# Altium project 声源跟踪小车_Project.PrjPcb
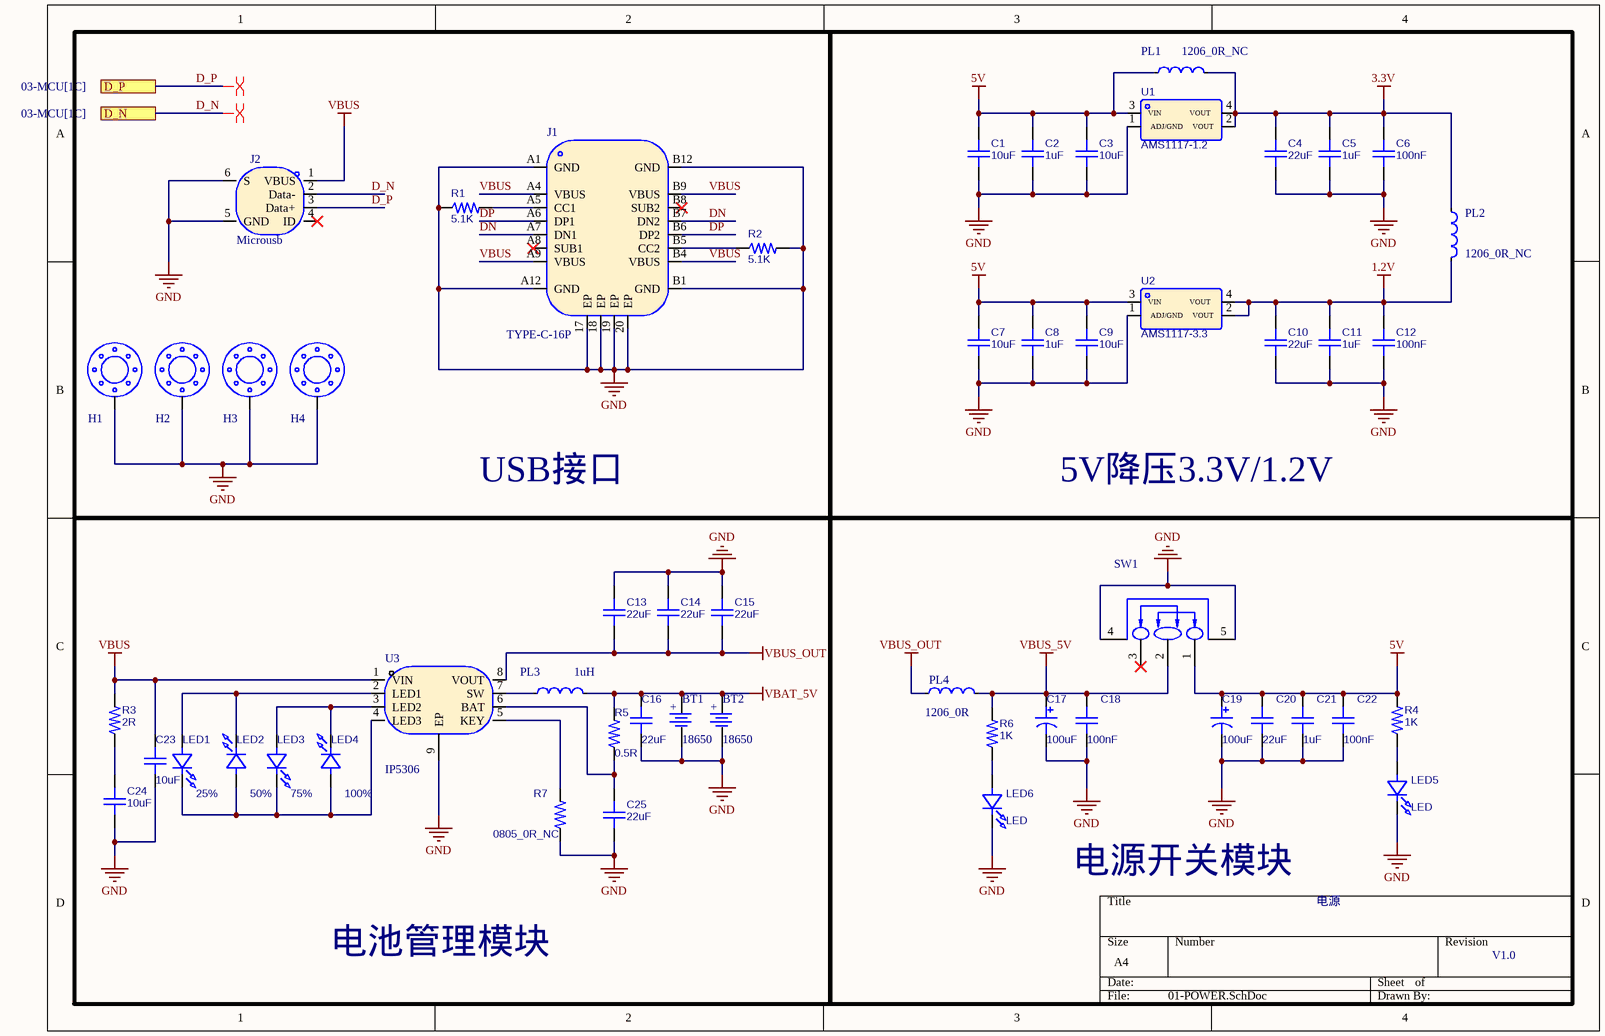
[diagram p0: 01-POWER.SchDoc]
3 sheets, 235 parts. Net scope: flat (ports and power ports of the same name join across sheets).
Board file: PCB1.PcbDoc
Sheets:
  01-POWER.SchDoc
  02-MIC.SchDoc
  03-MCU.SchDoc

## Sheet 01-POWER.SchDoc
size A4; SheetNumber: 1; SheetTotal: 2

### Parts
BT1  18650  [BAT-SMD-18650]
BT2  18650  [BAT-SMD-18650]
C1  10uF  [CAP-SMD-0603]
C2  1uF  [CAP-SMD-0603]
C3  10uF  [CAP-SMD-0603]
C4  22uF  [CAP-SMD-0603]
C5  1uF  [CAP-SMD-0603]
C6  100nF  [CAP-SMD-0603]
C7  10uF  [CAP-SMD-0603]
C8  1uF  [CAP-SMD-0603]
C9  10uF  [CAP-SMD-0603]
C10  22uF  [CAP-SMD-0603]
C11  1uF  [CAP-SMD-0603]
C12  100nF  [CAP-SMD-0603]
C13  22uF  [CAP-SMD-0603]
C14  22uF  [CAP-SMD-0603]
C15  22uF  [CAP-SMD-0603]
C16  22uF  [CAP-SMD-0603]
C17  100uF  [CAPA-TH-5020-P2.0]
C18  100nF  [CAP-SMD-0603]
C19  100uF  [CAPA-TH-5020-P2.0]
C20  22uF  [CAP-SMD-0603]
C21  1uF  [CAP-SMD-0603]
C22  100nF  [CAP-SMD-0603]
C23  10uF  [CAP-SMD-0603]
C24  10uF  [CAP-SMD-0603]
C25  22uF  [CAP-SMD-0603]
H1  M3  [M3-5030-0.3]  (value not drawn)
H2  M3  [M3-5030-0.3]  (value not drawn)
H3  M3  [M3-5030-0.3]  (value not drawn)
H4  M3  [M3-5030-0.3]  (value not drawn)
J1  TYPE-C-16P  [TYPE-C-SMD-16P]
J2  Microusb  [Microusb-SMD-5P]
LED1  25%  [LED-SMD-0805]
LED2  50%  [LED-SMD-0805]
LED3  75%  [LED-SMD-0805]
LED4  100%  [LED-SMD-0805]
LED5  LED  [LED-SMD-0805]
LED6  LED  [LED-SMD-0805]
PL1  1206_0R_NC  [PL-SMD_4.4X4.2-P3.7]
PL2  1206_0R_NC  [PL-SMD_4.4X4.2-P3.7]
PL3  1uH  [PL-SMD_4.4X4.2-P3.7]
PL4  1206_0R  [PL-SMD_4.4X4.2-P3.7]
R1  5.1K  [RES-SMD-0603]
R2  5.1K  [RES-SMD-0603]
R3  2R  [RES-SMD-0603]
R4  1K  [RES-SMD-0603]
R5  0.5R  [RES-SMD-0603]
R6  1K  [RES-SMD-0603]
R7  0805_0R_NC  [RES-SMD-0603]
SW1  SS-12D11G5  [SW-TH-D-P4.8]  (value not drawn)
U1  AMS1117-1.2  [SOT-223-4-LP5.7-P2.3]
U2  AMS1117-3.3  [SOT-223-4-LP5.7-P2.3]
U3  IP5306  [ESOP-8-LP5.3-P1.27]

### Blocks framed on the sheet
USB接口: H1-H4 J1 J2 R1 R2
5V降压3.3V/1.2V: C1-C12 PL1 PL2 U1 U2
电池管理模块: BT1 BT2 C13-C16 C23-C25 LED1-LED4 PL3 R3 R5 R7 U3
电源开关模块: C17-C22 LED5 LED6 PL4 R4 R6 SW1

### Ports
D_N (see 03-MCU[1C]), D_P (see 03-MCU[1C])

### Nets
1.2V: C10.2 C11.2 C12.2 PL2.2 U2.2(VOUT) U2.4(VOUT)
3.3V: C4.2 C5.2 C6.2 PL1.2 PL2.1 U1.2(VOUT) U1.4(VOUT)
5V: C1.2 C2.2 C3.2 C7.2 C8.2 C9.2 C19.1 C20.2 C21.2 C22.2 PL1.1 R4.2 SW1.1 U1.3(VIN) U2.3(VIN)
GND: BT1.2(+) BT2.2(+) C1.1 C2.1 C3.1 C4.1 C5.1 C6.1 C7.1 C8.1 C9.1 C10.1 C11.1 C12.1 C13.2 C14.2 C15.2 C16.1 C17.2 C18.1 C19.2 C20.1 C21.1 C22.1 C23.1 C24.1 C25.1 H1.1 H2.1 H3.1 H4.1 J1.17(EP) J1.18(EP) J1.19(EP) J1.20(EP) J1.A1(GND) J1.A12(GND) J1.B1(GND) J1.B12(GND) J2.5(GND) J2.6(S) LED5.2(K) LED6.2(K) R1.1 R2.2 R7.1 SW1.4 SW1.5 U1.1(ADJ/GND) U2.1(ADJ/GND) U3.9(EP)
VBAT_5V: BT1.1(-) BT2.1(-) C16.2 PL3.2 R5.2
VBUS: C23.2 J1.A4(VBUS) J1.A9(VBUS) J1.B4(VBUS) J1.B9(VBUS) J2.1(VBUS) R3.2 U3.1(VIN)
VBUS_5V: C17.1 C18.2 PL4.2 R6.2 SW1.2
VBUS_OUT: C13.1 C14.1 C15.1 PL4.1 U3.8(VOUT)
D_N: J2.2(Data-) ; port D_N
D_P: J2.3(Data+) ; port D_P
DN: J1.A7(DN1) J1.B7(DN2)
DP: J1.A6(DP1) J1.B6(DP2)
NetC24_2: C24.2 R3.1
NetC25_2: C25.2 R5.1 U3.6(BAT)
NetJ1_A5: J1.A5(CC1) R1.2
NetJ1_B5: J1.B5(CC2) R2.1
NetLED1_1: LED1.1(A) LED2.2(K) U3.2(LED1)
NetLED1_2: LED1.2(K) LED2.1(A) LED3.2(K) LED4.1(A) U3.4(LED3)
NetLED3_1: LED3.1(A) LED4.2(K) U3.3(LED2)
NetLED5_1: LED5.1(A) R4.1
NetLED6_1: LED6.1(A) R6.1
NetPL3_1: PL3.1 U3.7(SW)
NetR7_2: R7.2 U3.5(KEY)

Not connected (* = marked no-connect by the designer): J1 A8(SUB1)* B8(SUB2)*; J2 4(ID)*; SW1 3*

### Layout directives
differential pair: D_N, D_P

### Notes on the sheet
- 电源
- V1.0

### Library data of the parts
BT1 BT2 = CR2032: 纽扣电池CR2032-BS-6-1; Manufacturer: Q&J; Add into BOM: yes; Connector Type: 电池底座; Symbol: CR2032-BS-6-1; Device: CR2032-BS-6-1; LCSC Part Name: 电池底座 适用电池:CR2032; Supplier Part: C70377; Manufacturer Part: CR2032-BS-6-1; Supplier Footprint: SMD; JLCPCB Part Class: Extended Part; Datasheet: https://atta.szlcsc.com/upload/public/pdf/source/20160427/1461725216549.pdf; Supplier: LCSC; Convert to PCB: yes; Battery Type: CR2032; Operating Temperature Range: -
C1-C16 C18 C20-C25 = CAP: 贴片电容; BOM_Manufacturer: SAMSUNG; BOM_Manufacturer Part: CL03A104KQ3NNNC; nameAlias: Capacitance; Contributor: LCSC; BOM_Supplier: LCSC; BOM_Supplier Part: C160831; BOM_JLCPCB Part Class: Extended Part; spicePre: C; spiceSymbolName: CL03A104KQ3NNNC
C17 C19 = CAPA: 电解电容; BOM_Manufacturer: ValuePro; BOM_Manufacturer Part: 普通黑色470UF 50V; nameAlias: Capacitance; BOM_Supplier: LCSC; BOM_Supplier Part: C34642; BOM_JLCPCB Part Class: Extended Part; spicePre: C; spiceSymbolName: 470UF 50V
H1-H4 = M3: M3螺丝孔
J1 = TYPE-C-16P: TYPE-C-16pin; Manufacturer: kinghelm(金航标); Symbol: KH-TYPE-C-16P; Add into BOM: yes; Connector Type: Type-C; Gender: 母座; Number of Contacts: 16; Number of Ports: 1; Current Rating - Power (Max): 3A; Device: KH-TYPE-C-16P; LCSC Part Name: Type-C 母座 卧贴; Supplier Part: C709357; Manufacturer Part: KH-TYPE-C-16P; Supplier Footprint: SMD; JLCPCB Part Class: Extended Part; Datasheet: https://atta.szlcsc.com/upload/public/pdf/source/20200911/C709357_AA8DCEB38BB20E3035A7ED7AE7667837.pdf; Supplier: LCSC; Convert to PCB: yes; Standard: -; Mounting Style: 卧贴; Operating Temperature Range: -40~+85
J2 = Microusb-5P: 安卓阶梯型USB接口; Manufacturer: Amphenol; Symbol: 10118194-0001LF; Add into BOM: yes; Connector Type: Micro-B; Gender: 母座; Number of Contacts: 5; Number of Ports: 1; Device: 10118194-0001LF; LCSC Part Name: Micro-B 母座; Supplier Part: C132563; Manufacturer Part: 10118194-0001LF; Supplier Footprint: SMD; JLCPCB Part Class: Extended Part; Datasheet: https://atta.szlcsc.com/upload/public/pdf/source/20210630/C132563_323781699BE9D7BFAD8DF70EA5820798.pdf; Supplier: LCSC; Convert to PCB: yes; Standard: USB 2.0
LED1-LED6 = LED: LED灯,发光二极管; BOM_Manufacturer: yongyu(永裕光电); BOM_Manufacturer Part: SZYY0402B; Contributor: LCSC; BOM_Supplier: LCSC; BOM_Supplier Part: C434447; spicePre: L; spiceSymbolName: SZYY0402B
PL1-PL4 = PL-IND: 电感; Manufacturer: Sunlord(顺络); Symbol: GZ1608D121TF-C12391; Device: GZ1608D121TF; Add into BOM: yes; Impedance @ Frequency: 120Ω@100MHz; Tolerance: ±25%; DC Resistance: 200mΩ; Current Rating: 300mA; Circuits: 1; LCSC Part Name: 120Ω@100MHz ±25%; Supplier Part: C12391; Manufacturer Part: GZ1608D121TF; Supplier Footprint: 0603; JLCPCB Part Class: Extended Part; Datasheet: https://atta.szlcsc.com/upload/public/pdf/source/20210830/355EA7C0FAC5394FC0FE3F17C770C20A.pdf; Supplier: LCSC; Convert to PCB: yes
R1-R7 = RES: 贴片电阻; BOM_Manufacturer: Chengdu Guosheng Tech; BOM_Manufacturer Part: 3362P-1-104; Resistance(Ohms): 100K; nameAlias: Resistance; Contributor: LCSC; BOM_Supplier: LCSC; BOM_Supplier Part: C118966; Resistance (Ohms): 100K; BOM_JLCPCB Part Class: Extended Part; spicePre: R; spiceSymbolName: 3362P-1-104_C118966
SW1 = SW-D-3P: 额定电流(DC)：3A 额定电压(DC)：125V 额定电流(AC)：3A 额定电压(AC)：125V; Manufacturer: XKB Connectivity(中国星坤); Add into BOM: yes; Current Rating (DC): 3A; Voltage Rating (DC): 125V; Circuit: 单刀双掷; Mechanical Life: 10000; Actuator Color: 黑色; Actuator Style: 矩形柱状; Pin Style: PC引脚; Switch Length: 13.5mm; Switch Width: 6.6mm; Switch Height: 6.3mm; Name: SS-12D11G5; Symbol: SS-12D11G5; Device: SS-12D11G5; LCSC Part Name: SS-12D11G5; Supplier Part: C692484; Manufacturer Part: SS-12D11G5; Supplier Footprint: 插件; JLCPCB Part Class: 扩展库; Datasheet: https://atta.szlcsc.com/upload/public/pdf/source/20211009/84F89DEF741E27E9E55DE4039DC07CAD.pdf; Supplier: LCSC; Convert to PCB: yes; Current Rating (AC): 3A; Voltage Rating (AC): 125V; Mounting Style: 弯插; Operating Temperature: -40~+85
U1 = AMS1117-5.0: 稳压器芯片; BOM_Manufacturer: JSMSEMI(杰盛微); Contributor: LCSC; BOM_Supplier: LCSC; BOM_Supplier Part: C2718490; BOM_Manufacturer Part: AMS1117-5.0; BOM_JLCPCB Part Class: Extended Part; spicePre: U; spiceSymbolName: AMS1117-5.0_C2718490
U2 = AMS1117-5.0_1: 稳压器芯片; BOM_Manufacturer: JSMSEMI(杰盛微); Contributor: LCSC; BOM_Supplier: LCSC; BOM_Supplier Part: C2718490; BOM_Manufacturer Part: AMS1117-5.0; BOM_JLCPCB Part Class: Extended Part; spicePre: U; spiceSymbolName: AMS1117-5.0_C2718490
U3 = IP5306: 充电电池的类型:-;电池单元组数:-;最大充电电流:-;充满的电池组电压:-;最大供应电压:-;; Manufacturer: INJOINIC(英集芯); Add into BOM: yes; Name: IP5306; Symbol: IP5306; Device: IP5306; LCSC Part Name: IP5306; Supplier Part: C181692; Manufacturer Part: IP5306; Supplier Footprint: ESOP-8; JLCPCB Part Class: 扩展库; Datasheet: https://atta.szlcsc.com/upload/public/pdf/source/20180920/C181692_842C9BF636DF123BB66E91FC1AD6F13F.pdf; Supplier: LCSC; Convert to PCB: yes; Battery Chemistry: -; Number of Cells: -; Charge Current - Max: -; Battery Pack Voltage: -; Voltage - Supply (Max): -; Interface: -

## Sheet 02-MIC.SchDoc
size A4; SheetNumber: 2; SheetTotal: 3
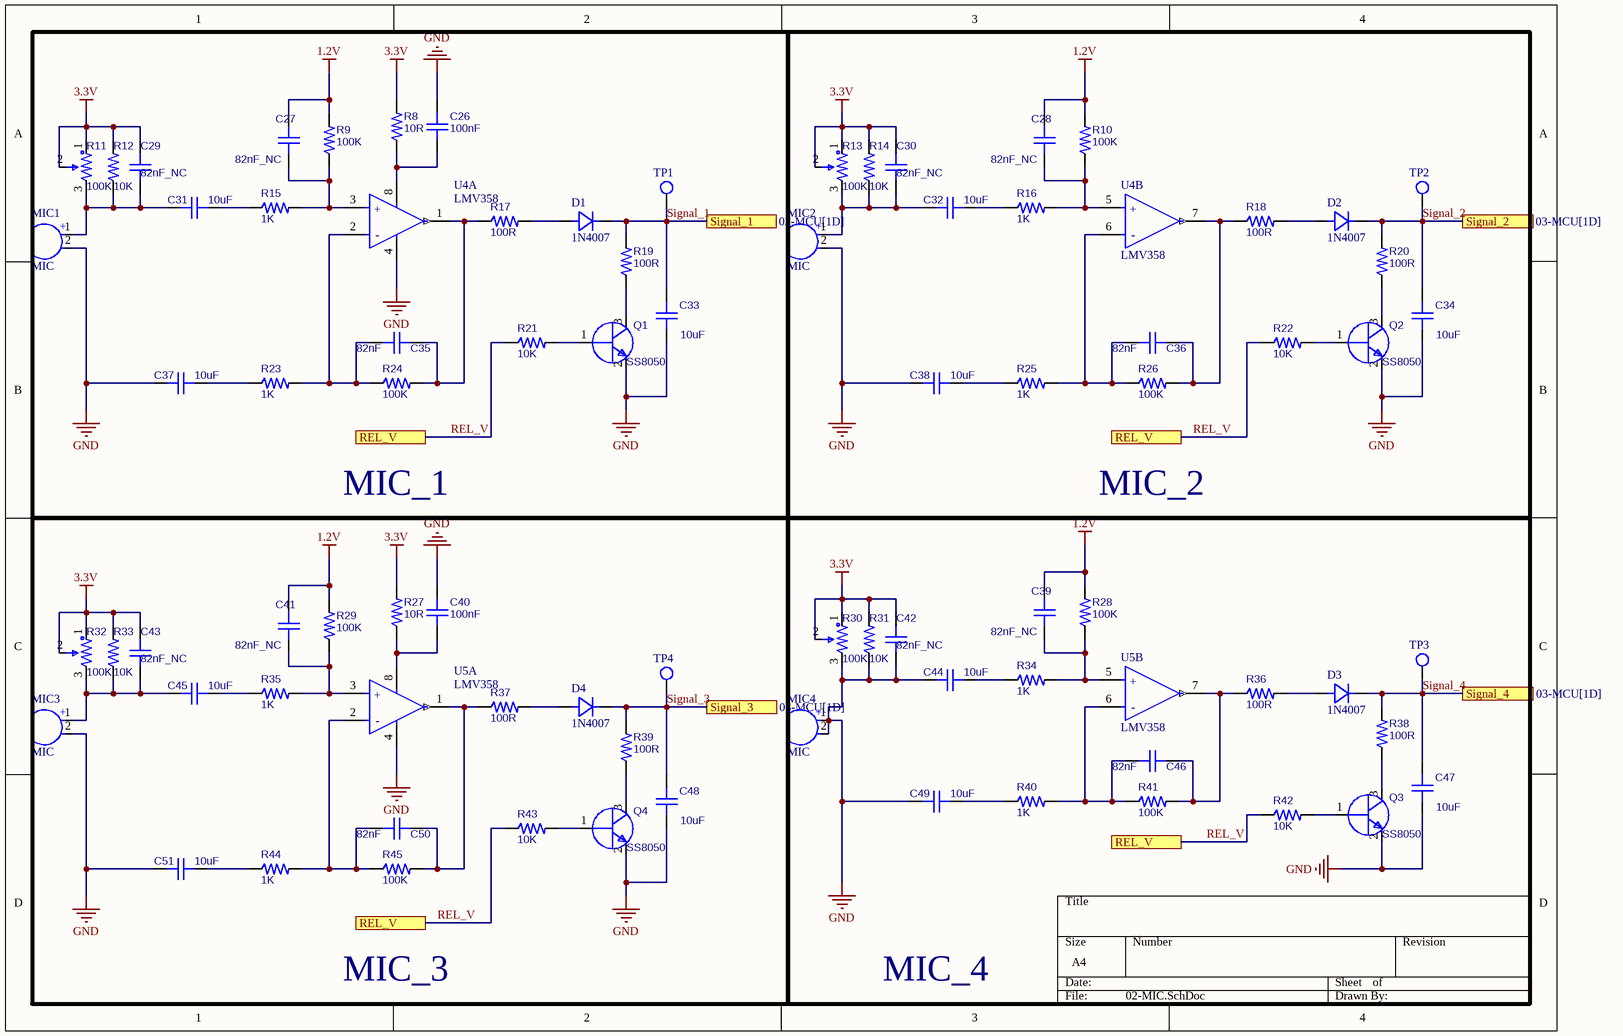
[diagram p1: 02-MIC.SchDoc]

### Parts
C26  100nF  [CAP-SMD-0603]
C27  82nF_NC  [CAP-SMD-0603]
C28  82nF_NC  [CAP-SMD-0603]
C29  82nF_NC  [CAP-SMD-0603]
C30  82nF_NC  [CAP-SMD-0603]
C31  10uF  [CAP-SMD-0603]
C32  10uF  [CAP-SMD-0603]
C33  10uF  [CAP-SMD-0603]
C34  10uF  [CAP-SMD-0603]
C35  82nF  [CAP-SMD-0603]
C36  82nF  [CAP-SMD-0603]
C37  10uF  [CAP-SMD-0603]
C38  10uF  [CAP-SMD-0603]
C39  82nF_NC  [CAP-SMD-0603]
C40  100nF  [CAP-SMD-0603]
C41  82nF_NC  [CAP-SMD-0603]
C42  82nF_NC  [CAP-SMD-0603]
C43  82nF_NC  [CAP-SMD-0603]
C44  10uF  [CAP-SMD-0603]
C45  10uF  [CAP-SMD-0603]
C46  82nF  [CAP-SMD-0603]
C47  10uF  [CAP-SMD-0603]
C48  10uF  [CAP-SMD-0603]
C49  10uF  [CAP-SMD-0603]
C50  82nF  [CAP-SMD-0603]
C51  10uF  [CAP-SMD-0603]
D1  1N4007  [SOD-123-P3.4]
D2  1N4007  [SOD-123-P3.4]
D3  1N4007  [SOD-123-P3.4]
D4  1N4007  [SOD-123-P3.4]
MIC1  MIC  [CONN-TH-1X2P-P2.54_2]
MIC2  MIC  [CONN-TH-1X2P-P2.54_2]
MIC3  MIC  [CONN-TH-1X2P-P2.54_2]
MIC4  MIC  [CONN-TH-1X2P-P2.54_2]
Q1  SS8050  [SOT-23-3-LP2.28-P1.91]
Q2  SS8050  [SOT-23-3-LP2.28-P1.91]
Q3  SS8050  [SOT-23-3-LP2.28-P1.91]
Q4  SS8050  [SOT-23-3-LP2.28-P1.91]
R8  10R  [RES-SMD-0603]
R9  100K  [RES-SMD-0603]
R10  100K  [RES-SMD-0603]
R11  100K  [RES-TH-ADJ-3396W]
R12  10K  [RES-SMD-0603]
R13  100K  [RES-TH-ADJ-3396W]
R14  10K  [RES-SMD-0603]
R15  1K  [RES-SMD-0603]
R16  1K  [RES-SMD-0603]
R17  100R  [RES-SMD-0603]
R18  100R  [RES-SMD-0603]
R19  100R  [RES-SMD-0603]
R20  100R  [RES-SMD-0603]
R21  10K  [RES-SMD-0603]
R22  10K  [RES-SMD-0603]
R23  1K  [RES-SMD-0603]
R24  100K  [RES-SMD-0603]
R25  1K  [RES-SMD-0603]
R26  100K  [RES-SMD-0603]
R27  10R  [RES-SMD-0603]
R28  100K  [RES-SMD-0603]
R29  100K  [RES-SMD-0603]
R30  100K  [RES-TH-ADJ-3396W]
R31  10K  [RES-SMD-0603]
R32  100K  [RES-TH-ADJ-3396W]
R33  10K  [RES-SMD-0603]
R34  1K  [RES-SMD-0603]
R35  1K  [RES-SMD-0603]
R36  100R  [RES-SMD-0603]
R37  100R  [RES-SMD-0603]
R38  100R  [RES-SMD-0603]
R39  100R  [RES-SMD-0603]
R40  1K  [RES-SMD-0603]
R41  100K  [RES-SMD-0603]
R42  10K  [RES-SMD-0603]
R43  10K  [RES-SMD-0603]
R44  1K  [RES-SMD-0603]
R45  100K  [RES-SMD-0603]
TP1  TP  [TP]  (value not drawn)
TP2  TP  [TP]  (value not drawn)
TP3  TP  [TP]  (value not drawn)
TP4  TP  [TP]  (value not drawn)
U4  LMV358  [SOIC-8-LP5.5-P1.27]  (parts A,B of 2)
U5  LMV358  [SOIC-8-LP5.5-P1.27]  (parts A,B of 2)

### Blocks framed on the sheet
MIC_1: C26 C27 C29 C31 C33 C35 C37 D1 MIC1 Q1 R8 R9 R11 R12 R15 R17 R19 R21 R23 R24 TP1 U4
MIC_2: C28 C30 C32 C34 C36 C38 D2 MIC2 Q2 R10 R13 R14 R16 R18 R20 R22 R25 R26 TP2 U4
MIC_3: C40 C41 C43 C45 C48 C50 C51 D4 MIC3 Q4 R27 R29 R32 R33 R35 R37 R39 R43-R45 TP4 U5
MIC_4: C39 C42 C44 C46 C47 C49 D3 MIC4 Q3 R28 R30 R31 R34 R36 R38 R40-R42 TP3 U5

### Ports
REL_V (see 02-MIC[1B], 02-MIC[1D], 02-MIC[3B], 03-MCU[8C]), REL_V (see 02-MIC[1B], 02-MIC[1D], 02-MIC[3D], 03-MCU[8C]), REL_V (see 02-MIC[1B], 02-MIC[3B], 02-MIC[3D], 03-MCU[8C]), REL_V (see 02-MIC[1D], 02-MIC[3B], 02-MIC[3D], 03-MCU[8C]), Signal_1 (see 03-MCU[1D]), Signal_2 (see 03-MCU[1D]), Signal_3 (see 03-MCU[1D]), Signal_4 (see 03-MCU[1D])

### Nets
1.2V: C27.2 C28.2 C39.2 C41.2 R9.2 R10.2 R28.2 R29.2
3.3V: C29.2 C30.2 C42.2 C43.2 R8.2 R11.1 R11.2 R12.2 R13.1 R13.2 R14.2 R27.2 R30.1 R30.2 R31.2 R32.1 R32.2 R33.2
GND: C26.2 C33.1 C34.1 C37.1 C38.1 C40.2 C42.1 C44.1 C47.1 C48.1 C49.1 C51.1 MIC1.2(C) MIC2.2(C) MIC3.2(C) MIC4.1(A) MIC4.2(C) Q1.2(E) Q2.2(E) Q3.2(E) Q4.2(E) R30.3 R31.1 U4.4(GND) U5.4(GND)
REL_V: R21.1 R22.1 R42.1 R43.1 ; port REL_V
Signal_1: C33.2 D1.2(A) R19.2 TP1.1 ; port Signal_1
Signal_2: C34.2 D2.2(A) R20.2 TP2.1 ; port Signal_2
Signal_3: C48.2 D4.2(A) R39.2 TP4.1 ; port Signal_3
Signal_4: C47.2 D3.2(A) R38.2 TP3.1 ; port Signal_4
NetC26_1: C26.1 R8.1 U4.8(VCC+)
NetC27_1: C27.1 R9.1 R15.2 U4.3(1IN+)
NetC28_1: C28.1 R10.1 R16.2 U4.5(1IN+)
NetC29_1: C29.1 C31.1 MIC1.1(A) R11.3 R12.1
NetC30_1: C30.1 C32.1 MIC2.1(A) R13.3 R14.1
NetC31_2: C31.2 R15.1
NetC32_2: C32.2 R16.1
NetC35_1: C35.1 R23.2 R24.1 U4.2(1IN-)
NetC35_2: C35.2 R17.1 R24.2 U4.1(OUT)
NetC36_1: C36.1 R25.2 R26.1 U4.6(1IN-)
NetC36_2: C36.2 R18.1 R26.2 U4.7(OUT)
NetC37_2: C37.2 R23.1
NetC38_2: C38.2 R25.1
NetC39_1: C39.1 R28.1 R34.2 U5.5(1IN+)
NetC40_1: C40.1 R27.1 U5.8(VCC+)
NetC41_1: C41.1 R29.1 R35.2 U5.3(1IN+)
NetC43_1: C43.1 C45.1 MIC3.1(A) R32.3 R33.1
NetC44_2: C44.2 R34.1
NetC45_2: C45.2 R35.1
NetC46_1: C46.1 R40.2 R41.1 U5.6(1IN-)
NetC46_2: C46.2 R36.1 R41.2 U5.7(OUT)
NetC49_2: C49.2 R40.1
NetC50_1: C50.1 R44.2 R45.1 U5.2(1IN-)
NetC50_2: C50.2 R37.1 R45.2 U5.1(OUT)
NetC51_2: C51.2 R44.1
NetD1_1: D1.1(K) R17.2
NetD2_1: D2.1(K) R18.2
NetD3_1: D3.1(K) R36.2
NetD4_1: D4.1(K) R37.2
NetQ1_1: Q1.1(B) R21.2
NetQ1_3: Q1.3(C) R19.1
NetQ2_1: Q2.1(B) R22.2
NetQ2_3: Q2.3(C) R20.1
NetQ3_1: Q3.1(B) R42.2
NetQ3_3: Q3.3(C) R38.1
NetQ4_1: Q4.1(B) R43.2
NetQ4_3: Q4.3(C) R39.1

### Notes on the sheet
- (in symbol LMV358, part A) +; -
- (in symbol LMV358, part B) +; -
- (in symbol MIC) +

### Library data of the parts
C26-C51 = CAP: as C1 on sheet 01-POWER; BOM_Supplier: LCSC; BOM_Supplier Part: C160831; BOM_JLCPCB Part Class: Extended Part; spicePre: C; spiceSymbolName: CL03A104KQ3NNNC
D1-D4 = Diode: 二极管1N4148W; Manufacturer: PSI(宝力芯); Symbol: 1N4148W_C2840890; Add into BOM: yes; Power Dissipation: 350mW; Reverse Voltage (Vr): 100V; Average Rectified Current (Io): 150mA; Forward Voltage (Vf@If): 1.25V@150mA; Reverse Leakage Current: 1A@75V; Reverse Recovery Time (trr): 4ns; Device: 1N4148W; LCSC Part Name: 100V 150mA 4ns; Supplier Part: C2840890; Manufacturer Part: 1N4148W; Supplier Footprint: SOD-123; JLCPCB Part Class: Extended Part; Datasheet: https://atta.szlcsc.com/upload/public/pdf/source/20210709/C2840890_3AF002B6505A4091F26B54E36362ABEF.pdf; Supplier: LCSC; Convert to PCB: yes; Diode Configuration: -; Operating Temperature: +150@(Tj)
MIC1-MIC4 = MIC: 咪头MIC COND ANALOG OMNI -38DB
Q1-Q4 = NPN-SOT-23-3: 贴片NPN三极管; BOM_Manufacturer: YFW佑风微; BOM_Manufacturer Part: S9013; Contributor: LCSC; BOM_Supplier: LCSC; BOM_Supplier Part: C2898668; BOM_JLCPCB Part Class: Extended Part; spicePre: Q; spiceSymbolName: S9013_C2898668
R8 R12 R14-R23 R25 R27 R31 R33-R40 R42-R44 = RES: as R1 on sheet 01-POWER; BOM_Supplier: LCSC; BOM_Supplier Part: C118966; Resistance (Ohms): 100K; BOM_JLCPCB Part Class: Extended Part; spicePre: R; spiceSymbolName: 3362P-1-104_C118966
R9 R10 R24 R26 R28 R29 R41 R45 = RES: 贴片电阻; BOM_Manufacturer: Chengdu Guosheng Tech; BOM_Manufacturer Part: 3362P-1-104; nameAlias: Resistance; Contributor: LCSC; BOM_Supplier: LCSC; BOM_Supplier Part: C118966; Resistance(Ohms): 100K; Resistance (Ohms): 100K; BOM_JLCPCB Part Class: Extended Part; spicePre: R; spiceSymbolName: 3362P-1-104_C118966
R11 R13 R30 R32 = RES-ADJ: 可调电阻,电位器; BOM_Manufacturer: Chengdu Guosheng Tech; BOM_Manufacturer Part: 3362P-1-104; nameAlias: Resistance; Contributor: LCSC; BOM_Supplier: LCSC; BOM_Supplier Part: C118966; Resistance(Ohms): 100K; Resistance (Ohms): 100K; BOM_JLCPCB Part Class: Extended Part; spicePre: R; spiceSymbolName: 3362P-1-104_C118966
TP1-TP4 = TP: TP测试点
U4 U5 = LMV358: 运放IC OPAMP GP 2 CIRCUIT 8SOIC

## Sheet 03-MCU.SchDoc
size A3; SheetNumber: 3; SheetTotal: 3
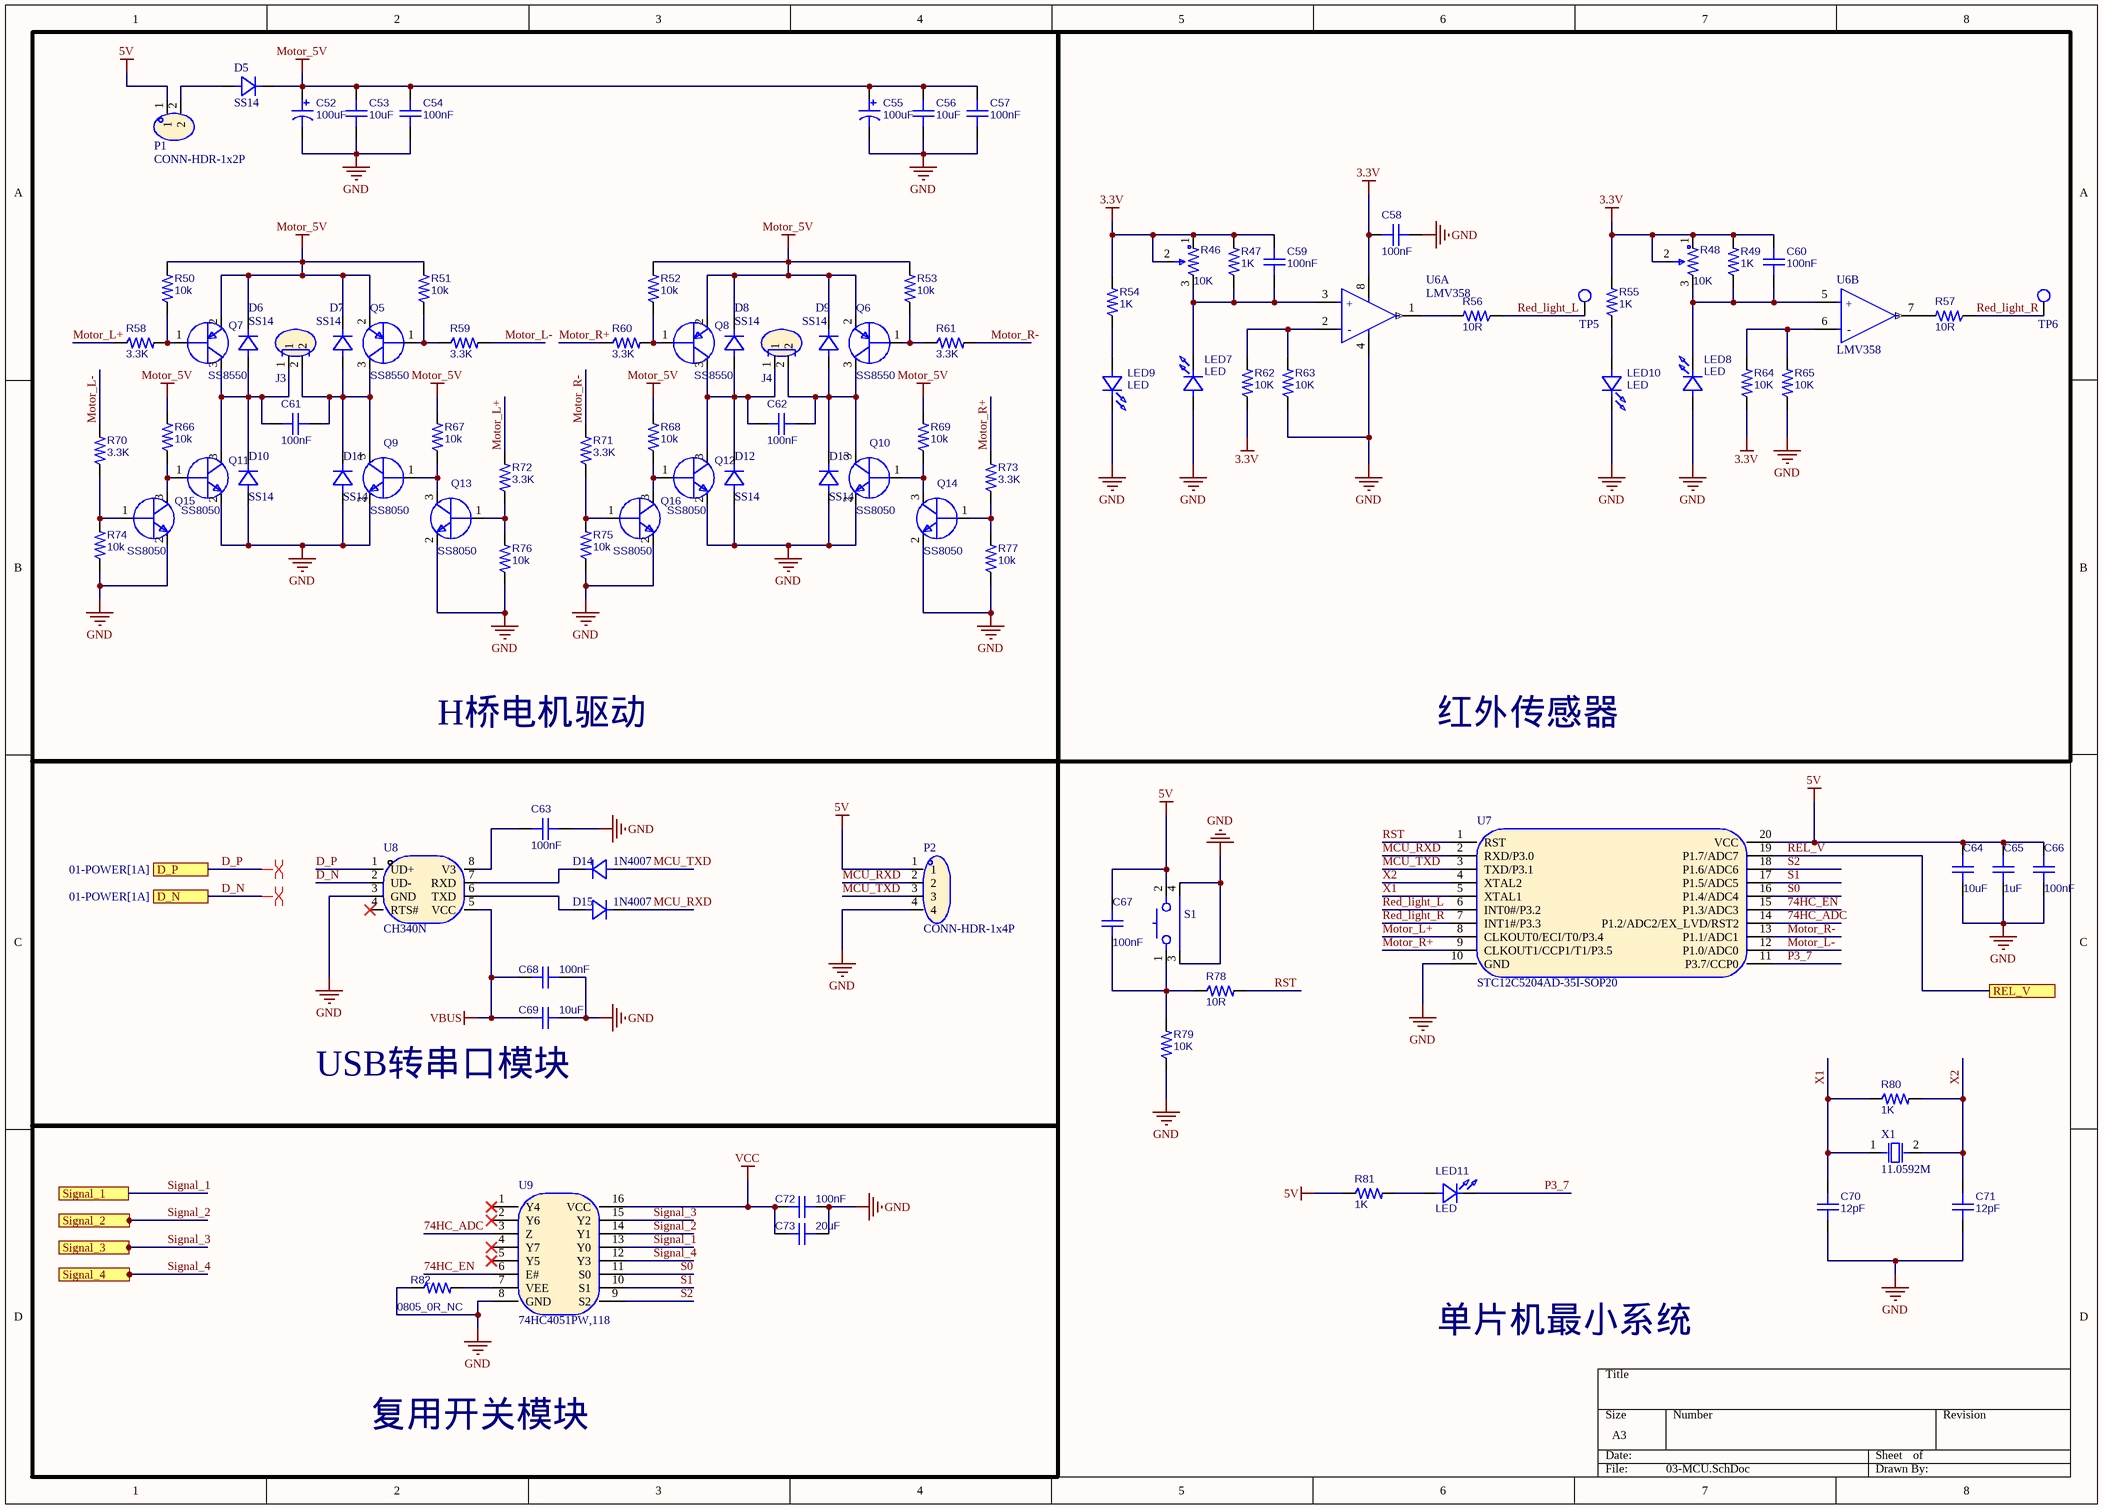
[diagram p2: 03-MCU.SchDoc]

### Parts
C52  100uF  [CAPA-TH-5020-P2.0]
C53  10uF  [CAP-SMD-0603]
C54  100nF  [CAP-SMD-0603]
C55  100uF  [CAPA-TH-5020-P2.0]
C56  10uF  [CAP-SMD-0603]
C57  100nF  [CAP-SMD-0603]
C58  100nF  [CAP-SMD-0603]
C59  100nF  [CAP-SMD-0603]
C60  100nF  [CAP-SMD-0603]
C61  100nF  [CAP-SMD-0603]
C62  100nF  [CAP-SMD-0603]
C63  100nF  [CAP-SMD-0603]
C64  10uF  [CAP-SMD-0603]
C65  1uF  [CAP-SMD-0603]
C66  100nF  [CAP-SMD-0603]
C67  100nF  [CAP-SMD-0603]
C68  100nF  [CAP-SMD-0603]
C69  10uF  [CAP-SMD-0603]
C70  12pF  [CAP-SMD-0603]
C71  12pF  [CAP-SMD-0603]
C72  100nF  [CAP-SMD-0603]
C73  20uF  [CAP-SMD-0603]
D5  SS14  [SOD-123-P3.4]
D6  SS14  [SOD-123-P3.4]
D7  SS14  [SOD-123-P3.4]
D8  SS14  [SOD-123-P3.4]
D9  SS14  [SOD-123-P3.4]
D10  SS14  [SOD-123-P3.4]
D11  SS14  [SOD-123-P3.4]
D12  SS14  [SOD-123-P3.4]
D13  SS14  [SOD-123-P3.4]
D14  1N4007  [SOD-123-P3.4]
D15  1N4007  [SOD-123-P3.4]
J3  CONN-2P  [CONN-TH-CDS-1x2P-P2.54]  (value not drawn)
J4  CONN-2P  [CONN-TH-CDS-1x2P-P2.54]  (value not drawn)
LED7  LED  [LED-TH-D5.0-P2.54]
LED8  LED  [LED-TH-D5.0-P2.54]
LED9  LED  [LED-TH-D5.0-P2.54]
LED10  LED  [LED-TH-D5.0-P2.54]
LED11  LED  [LED-SMD-0805]
P1  CONN-HDR-1x2P  [CONN-TH-1X2P-P2.54]
P2  CONN-HDR-1x4P  [CONN-TH-1X4P-P2.54]
Q5  SS8550  [SOT-23-3-LP2.28-P1.91]
Q6  SS8550  [SOT-23-3-LP2.28-P1.91]
Q7  SS8550  [SOT-23-3-LP2.28-P1.91]
Q8  SS8550  [SOT-23-3-LP2.28-P1.91]
Q9  SS8050  [SOT-23-3-LP2.28-P1.91]
Q10  SS8050  [SOT-23-3-LP2.28-P1.91]
Q11  SS8050  [SOT-23-3-LP2.28-P1.91]
Q12  SS8050  [SOT-23-3-LP2.28-P1.91]
Q13  SS8050  [SOT-23-3-LP2.28-P1.91]
Q14  SS8050  [SOT-23-3-LP2.28-P1.91]
Q15  SS8050  [SOT-23-3-LP2.28-P1.91]
Q16  SS8050  [SOT-23-3-LP2.28-P1.91]
R46  10K  [RES-TH-ADJ-3396W]
R47  1K  [RES-SMD-0603]
R48  10K  [RES-TH-ADJ-3396W]
R49  1K  [RES-SMD-0603]
R50  10k  [RES-SMD-0603]
R51  10k  [RES-SMD-0603]
R52  10k  [RES-SMD-0603]
R53  10k  [RES-SMD-0603]
R54  1K  [RES-SMD-0603]
R55  1K  [RES-SMD-0603]
R56  10R  [RES-SMD-0603]
R57  10R  [RES-SMD-0603]
R58  3.3K  [RES-SMD-0603]
R59  3.3K  [RES-SMD-0603]
R60  3.3K  [RES-SMD-0603]
R61  3.3K  [RES-SMD-0603]
R62  10K  [RES-SMD-0603]
R63  10K  [RES-SMD-0603]
R64  10K  [RES-SMD-0603]
R65  10K  [RES-SMD-0603]
R66  10k  [RES-SMD-0603]
R67  10k  [RES-SMD-0603]
R68  10k  [RES-SMD-0603]
R69  10k  [RES-SMD-0603]
R70  3.3K  [RES-SMD-0603]
R71  3.3K  [RES-SMD-0603]
R72  3.3K  [RES-SMD-0603]
R73  3.3K  [RES-SMD-0603]
R74  10k  [RES-SMD-0603]
R75  10k  [RES-SMD-0603]
R76  10k  [RES-SMD-0603]
R77  10k  [RES-SMD-0603]
R78  10R  [RES-SMD-0603]
R79  10K  [RES-SMD-0603]
R80  1K  [RES-SMD-0603]
R81  1K  [RES-SMD-0603]
R82  0805_0R_NC  [RES-SMD-0603]
S1  KEY-B-2P  [KEY-TH-B-2P]  (value not drawn)
TP5  TP  [TP]  (value not drawn)
TP6  TP  [TP]  (value not drawn)
U6  LMV358  [SOIC-8-LP5.5-P1.27]  (parts A,B of 2)
U7  STC12C5204AD-35I-SOP20  [SOP-20]
U8  CH340N  [SOP-8-LP5.3-P1.27]
U9  74HC4051PW,118  [TSSOP-16-LP5.7-P0.65]
X1  11.0592M  [OSC-5032-SMD-2P]

### Blocks framed on the sheet
H桥电机驱动: C52-C57 C61 C62 D5-D13 J3 J4 P1 Q5-Q16 R50-R53 R58-R61 R66-R77
红外传感器: C58-C60 LED7-LED10 R46-R49 R54-R57 R62-R65 TP5 TP6 U6
USB转串口模块: C63 C68 C69 D14 D15 P2 U8
复用开关模块: C72 C73 R82 U9

### Ports
D_N (see 01-POWER[1A]), D_P (see 01-POWER[1A]), REL_V (see 02-MIC[1B], 02-MIC[1D], 02-MIC[3B], 02-MIC[3D]), Signal_1 (see 02-MIC[2A]), Signal_2 (see 02-MIC[4A]), Signal_3 (see 02-MIC[2C]), Signal_4 (see 02-MIC[4C])

### Nets
3.3V: C58.2 C59.2 C60.2 R46.1 R46.2 R47.2 R48.1 R48.2 R49.2 R54.2 R55.2 R62.1 R64.1 U6.8(VCC+)
5V: C64.2 C65.2 C66.2 C67.2 P1.1 P2.1 R81.1 S1.2 U7.20(VCC)
GND: C52.2 C53.1 C54.1 C55.2 C56.1 C57.1 C58.1 C63.2 C64.1 C65.1 C66.1 C68.2 C69.2 C70.1 C71.1 C72.2 C73.2 D10.1(K) D11.1(K) D12.1(K) D13.1(K) LED7.1(A) LED8.1(A) LED9.2(K) LED10.2(K) P2.4 Q9.2(E) Q10.2(E) Q11.2(E) Q12.2(E) Q13.2(E) Q14.2(E) Q15.2(E) Q16.2(E) R63.1 R65.1 R74.1 R75.1 R76.1 R77.1 R79.1 R82.1 S1.3 S1.4 U6.4(GND) U7.10(GND) U8.3(GND) U9.8(GND)
Motor_5V: C52.1 C53.2 C54.2 C55.1 C56.2 C57.2 D5.2(A) D6.2(A) D7.2(A) D8.2(A) D9.2(A) Q5.2(E) Q6.2(E) Q7.2(E) Q8.2(E) R50.2 R51.2 R52.2 R53.2 R66.2 R67.2 R68.2 R69.2
VBUS: C68.1 C69.1 U8.5(VCC)
VCC: C72.1 C73.1 U9.16(VCC)
74HC_ADC: U7.14(P1.2/ADC2/EX_LVD/RST2) U9.3(Z)
74HC_EN: U7.15(P1.3/ADC3) U9.6(E#)
D_N: U8.2(UD-) ; port D_N
D_P: U8.1(UD+) ; port D_P
MCU_RXD: D15.2(A) P2.2 U7.2(RXD/P3.0)
MCU_TXD: D14.1(K) P2.3 U7.3(TXD/P3.1)
Motor_L+: R58.1 R72.2 U7.8(CLKOUT0/ECI/T0/P3.4)
Motor_L-: R59.2 R70.2 U7.12(P1.0/ADC0)
Motor_R+: R60.1 R73.2 U7.9(CLKOUT1/CCP1/T1/P3.5)
Motor_R-: R61.2 R71.2 U7.13(P1.1/ADC1)
P3_7: LED11.2(K) U7.11(P3.7/CCP0)
Red_light_L: R56.1 TP5.1 U7.6(INT0#/P3.2)
Red_light_R: R57.1 TP6.1 U7.7(INT1#/P3.3)
REL_V: U7.19(P1.7/ADC7) ; port REL_V
RST: R78.2 U7.1(RST)
S0: U7.16(P1.4/ADC4) U9.11(S0)
S1: U7.17(P1.5/ADC5) U9.10(S1)
S2: U7.18(P1.6/ADC6) U9.9(S2)
Signal_1: U9.13(Y0) ; port Signal_1
Signal_2: U9.14(Y1) ; port Signal_2
Signal_3: U9.15(Y2) ; port Signal_3
Signal_4: U9.12(Y3) ; port Signal_4
X1: C70.2 R80.1 U7.5(XTAL1) X1.1(OSC1)
X2: C71.2 R80.2 U7.4(XTAL2) X1.2(OSC2)
NetC59_1: C59.1 LED7.2(K) R46.3 R47.1 U6.3(1IN+)
NetC60_1: C60.1 LED8.2(K) R48.3 R49.1 U6.5(1IN+)
NetC61_1: C61.1 D6.1(K) D10.2(A) J3.1 Q7.3(C) Q11.3(C)
NetC61_2: C61.2 D7.1(K) D11.2(A) J3.2 Q5.3(C) Q9.3(C)
NetC62_1: C62.1 D8.1(K) D12.2(A) J4.1 Q8.3(C) Q12.3(C)
NetC62_2: C62.2 D9.1(K) D13.2(A) J4.2 Q6.3(C) Q10.3(C)
NetC63_1: C63.1 U8.8(V3)
NetC67_1: C67.1 R78.1 R79.2 S1.1
NetD5_1: D5.1(K) P1.2
NetD14_2: D14.2(A) U8.7(RXD)
NetD15_1: D15.1(K) U8.6(TXD)
NetLED9_1: LED9.1(A) R54.1
NetLED10_1: LED10.1(A) R55.1
NetLED11_1: LED11.1(A) R81.2
NetQ5_1: Q5.1(B) R51.1 R59.1
NetQ6_1: Q6.1(B) R53.1 R61.1
NetQ7_1: Q7.1(B) R50.1 R58.2
NetQ8_1: Q8.1(B) R52.1 R60.2
NetQ9_1: Q9.1(B) Q13.3(C) R67.1
NetQ10_1: Q10.1(B) Q14.3(C) R69.1
NetQ11_1: Q11.1(B) Q15.3(C) R66.1
NetQ12_1: Q12.1(B) Q16.3(C) R68.1
NetQ13_1: Q13.1(B) R72.1 R76.2
NetQ14_1: Q14.1(B) R73.1 R77.2
NetQ15_1: Q15.1(B) R70.1 R74.2
NetQ16_1: Q16.1(B) R71.1 R75.2
NetR56_2: R56.2 U6.1(OUT)
NetR57_2: R57.2 U6.7(OUT)
NetR62_2: R62.2 R63.2 U6.2(1IN-)
NetR64_2: R64.2 R65.2 U6.6(1IN-)
NetR82_2: R82.2 U9.7(VEE)

Not connected (* = marked no-connect by the designer): U8 4(RTS#)*; U9 1(Y4)* 2(Y6)* 4(Y7)* 5(Y5)*

### Layout directives
differential pair: D_N, D_P

### Notes on the sheet
- 单片机最小系统
- (in symbol LMV358, part A) +; -
- (in symbol LMV358, part B) +; -

### Library data of the parts
C52 C55 = CAPA: as C17 on sheet 01-POWER; BOM_Supplier: LCSC; BOM_Supplier Part: C34642; BOM_JLCPCB Part Class: Extended Part; spicePre: C; spiceSymbolName: 470UF 50V
C53 C54 C56-C73 = CAP: as C1 on sheet 01-POWER; BOM_Supplier: LCSC; BOM_Supplier Part: C160831; BOM_JLCPCB Part Class: Extended Part; spicePre: C; spiceSymbolName: CL03A104KQ3NNNC
D5-D15 = Diode: as D1 on sheet 02-MIC; Device: 1N4148W; LCSC Part Name: 100V 150mA 4ns; Supplier Part: C2840890; Manufacturer Part: 1N4148W; Supplier Footprint: SOD-123; JLCPCB Part Class: Extended Part; Datasheet: https://atta.szlcsc.com/upload/public/pdf/source/20210709/C2840890_3AF002B6505A4091F26B54E36362ABEF.pdf; Supplier: LCSC; Convert to PCB: yes; Diode Configuration: -; Operating Temperature: +150@(Tj)
J3 J4 = CONN-2P: 连接插座2pin; Manufacturer: KEFA(科发); Symbol: KF301-5.0-2P; Add into BOM: yes; Pitch: 5mm; Number of PINs Per Row: 2; Current Rating (Max): 17A; Voltage Rating (Max): 250V; Wire Gauge - AWG: 14~22; Wire Gauge - mm?: 1.5; Device: KF301-5.0-2P; LCSC Part Name: 5mm 排数:1 每排P数:2 直针 可拼接 铜 环保; Supplier Part: C474881; Manufacturer Part: KF301-5.0-2P; Supplier Footprint: P=5mm; JLCPCB Part Class: Extended Part; Datasheet: https://atta.szlcsc.com/upload/public/pdf/source/20200115/C474881_883EFE2003339C40FD1BEEEFC9A18423.pdf; Supplier: LCSC; Convert to PCB: yes; Number of Rows: 1; Mounting Style: 直针; Operating Temperature Range: -30~+120; Color: 蓝色
LED7-LED11 = LED: as LED1 on sheet 01-POWER; BOM_Supplier: LCSC; BOM_Supplier Part: C434447; spicePre: L; spiceSymbolName: SZYY0402B
P1 = CONN-HDR-1x2P: 排针1*2pin; Manufacturer: kinghelm(金航标); Symbol: KH-2.54PH180-1X2P-L11.5; Add into BOM: yes; Pitch: 2.54mm; Pin Structure: 1x2P; Circluar Pins/Square Pins: 方针; Current Rating (Max): 3A; Device: KH-2.54PH180-1X2P-L11.5; LCSC Part Name: 2.54mm 1x2P; Supplier Part: C2905434; Manufacturer Part: KH-2.54PH180-1X2P-L11.5; Supplier Footprint: 插件,P=2.54mm; JLCPCB Part Class: Extended Part; Datasheet: https://atta.szlcsc.com/upload/public/pdf/source/20211019/75EAF9E0823F75B5BB441C07BAE9F5E6.pdf; Supplier: LCSC; Convert to PCB: yes; Number of Pins: 2; Number of Rows: 1; Row Spacing: -; Mounting Type: 直插; Voltage Rating (Max): -; Length of Mating Pin: 6mm; Insulation Height: 2.5mm; Length of End Connection Pin: 3mm; Contact Material: -; Operating Temperature Range: -40~+105; Color: 黑色
P2 = CONN-HDR-1x4P: 排针1*4pin; Manufacturer: Wcon(维峰电子); Symbol: 1125-1104G0S116C001; Add into BOM: yes; Pitch: 2.54mm; Pin Structure: 1x4P; Circluar Pins/Square Pins: 方针; Current Rating (Max): 3A; Voltage Rating (Max): 320V; Device: 1125-1104G0S116C001; LCSC Part Name: 2.54mm 1x4P; Supplier Part: C920779; Manufacturer Part: 1125-1104G0S116C001; Supplier Footprint: 插件,P=2.54mm; JLCPCB Part Class: Extended Part; Datasheet: https://atta.szlcsc.com/upload/public/pdf/source/20210514/C920781_63E6ED3EFA6284A9B57E07350A5F58E4.pdf; Supplier: LCSC; Convert to PCB: yes; Number of Pins: 4; Number of Rows: 1; Row Spacing: 2.54mm; Mounting Type: 直插; Length of Mating Pin: 6.1mm; Insulation Height: 2.5mm; Length of End Connection Pin: 3mm; Contact Material: 黄铜; Contact Plating: 金; Operating Temperature Range: -40~+105; Color: 黑色
Q5-Q8 = PNP-SOT-23-3: 贴片PNP三极管; BOM_Manufacturer: YONGYUTAI(永裕泰); BOM_Manufacturer Part: S9012; Contributor: LCSC; BOM_Supplier: LCSC; BOM_Supplier Part: C2891799; BOM_JLCPCB Part Class: Extended Part; spicePre: Q; spiceSymbolName: S9012_C2891799
Q9-Q16 = NPN-SOT-23-3: as Q1 on sheet 02-MIC; BOM_Supplier: LCSC; BOM_Supplier Part: C2898668; BOM_JLCPCB Part Class: Extended Part; spicePre: Q; spiceSymbolName: S9013_C2898668
R46 R48 = RES-ADJ: 可调电阻,电位器; BOM_Manufacturer: Chengdu Guosheng Tech; BOM_Manufacturer Part: 3362P-1-104; Resistance(Ohms): 100K; nameAlias: Resistance; Contributor: LCSC; BOM_Supplier: LCSC; BOM_Supplier Part: C118966; Resistance (Ohms): 100K; BOM_JLCPCB Part Class: Extended Part; spicePre: R; spiceSymbolName: 3362P-1-104_C118966
R47 R49-R82 = RES: as R1 on sheet 01-POWER; BOM_Supplier: LCSC; BOM_Supplier Part: C118966; Resistance (Ohms): 100K; BOM_JLCPCB Part Class: Extended Part; spicePre: R; spiceSymbolName: 3362P-1-104_C118966
S1 = KEY-B-2P: 按键开关B; Manufacturer: C&K; Symbol: PTS645VL83LFS; Add into BOM: yes; Device: PTS645VL83LFS; LCSC Part Name: 轻触开关; Supplier Part: C918856; Manufacturer Part: PTS645VL83LFS; Supplier Footprint: 插件; JLCPCB Part Class: Extended Part; Datasheet: https://atta.szlcsc.com/upload/public/pdf/source/20200930/C879394_D7DA174BB86F37E4F50AF53F8B4AE402.pdf; Supplier: LCSC; Convert to PCB: yes
TP5 TP6 = TP: TP测试点
U6 = LMV358: 运放IC OPAMP GP 2 CIRCUIT 8SOIC
U7 = STC12C5204AD-35I-SOP20: CPU内核:51系列;CPU最大主频:35MHz;工作电压范围:4V~5.5V;内部振荡器:有;外部时钟频率范围:-;程序 FLASH容量:4KB;RAM总容量:256Byte;EEPROM/数据 FLASH容量:1KB;GPIO端口数量:15;ADC(单元数/通道数/位数):1@x8ch/8bit;DAC(单元数/通道数/位数):-;(E)PWM(单元数/通道数/位数):-;8位Timer数量:-;16位Timer数量:2;32位Timer数量:-;内部比较器数量:-;U(S)ART路数:1;I2C路数; Manufacturer: STC(宏晶); Add into BOM: yes; CPU Core: 51系列; Maximum Frequency: 35MHz; Internal Oscillator: 有; Program FLASH Size: 4KB; EEPROM/Data FLASH Size: 1KB; GPIO Ports Number: 15; 16Bit Timer Number: 2; U(S)ART Number: 1; Peripherals / Functions / Protocol Stacks: 低电压检测；看门狗；CCP捕获/比较; Name: STC12C5204AD-35I-SOP20; Symbol: STC12C5204AD-35I; Device: STC12C5204AD-35I-SOP20; LCSC Part Name: STC12C5204AD-35I-SOP20; Supplier Part: C8703; Manufacturer Part: STC12C5204AD-35I-SOP20; Supplier Footprint: SOIC-20_300mil; JLCPCB Part Class: 扩展库; Datasheet: https://atta.szlcsc.com/upload/public/pdf/source/20120808/1457706523764.pdf; Supplier: LCSC; Convert to PCB: yes; Supply Voltage Range: 4V~5.5V; External Clock Frequency Rang: -; RAM Size: 256Byte; ADC (Units/Channels/bits): 1@x8ch/8bit; DAC (Units/Channels/bits): -; (E)PWM (Units/Channels/bits): -; 8Bit Timer Number: -; 32Bit Timer Number: -; CMP Number: -; I2C Number: -; I2S Number: -; (Q)SPI Number: -; CAN Number: -; USB (H/D/OTG): -; Operating Temperature Range: -40~+85
U8 = CH340N: Manufacturer: WCH(南京沁恒); Symbol: CH340N_C2977777; Add into BOM: yes; Name: CH340N; Device: CH340N; LCSC Part Name: CH340N; Supplier Part: C2977777; Manufacturer Part: CH340N; Supplier Footprint: SOP-8; JLCPCB Part Class: 扩展库; Datasheet: https://atta.szlcsc.com/upload/public/pdf/source/20220223/82A45E4FF89B3EDCAD50B354450A7EF4.pdf; Supplier: LCSC; Convert to PCB: yes
U9 = 74HC4051PW,118: 复用开关IC MUX/DEMUX 8X1; Manufacturer: Nexperia(安世); Add into BOM: yes; Name: 74HC4051PW,118; Symbol: 74HC4051PW,118; Device: 74HC4051PW,118; LCSC Part Name: 74HC4051PW,118; Supplier Part: C5645; Manufacturer Part: 74HC4051PW,118; Supplier Footprint: TSSOP-16; JLCPCB Part Class: 扩展库; Datasheet: https://atta.szlcsc.com/upload/public/pdf/source/20120413/1457706470089.pdf; Supplier: LCSC; Convert to PCB: yes
X1 = XTAL-2P-WY: 无源晶振2pin; Manufacturer: YXC扬兴科技; Symbol: X49SM16MSD2SI; Add into BOM: yes; Crystal Type: 49SMD; Frequency Tolerance: ±20ppm; Frequency Stability: ±30ppm; Load Capacitance: 20pF; Equivalent Series Resistance (ESR): 40Ω; Device: X49SM16MSD2SI; LCSC Part Name: 16MHz ±20ppm 20pF; Supplier Part: C90678; Manufacturer Part: X49SM16MSD2SI; Supplier Footprint: HC-49S/SMD; JLCPCB Part Class: Extended Part; Datasheet: https://atta.szlcsc.com/upload/public/pdf/source/20210329/C106809_0E91E60850A780B284B63D653DC40EA4.pdf; Supplier: LCSC; Convert to PCB: yes; Operating Temperature: -40~+85

## Nets that join several sheets
1.2V: 01-POWER (6 pins), 02-MIC (8 pins)
3.3V: 01-POWER (7 pins), 02-MIC (18 pins), 03-MCU (14 pins)
5V: 01-POWER (15 pins), 03-MCU (9 pins)
GND: 01-POWER (51 pins), 02-MIC (25 pins), 03-MCU (48 pins)
VBUS: 01-POWER (8 pins), 03-MCU (C68.1 C69.1 U8.5)
D_N: 01-POWER (J2.2), 03-MCU (U8.2)
D_P: 01-POWER (J2.3), 03-MCU (U8.1)
REL_V: 02-MIC (R21.1 R22.1 R42.1 R43.1), 03-MCU (U7.19)
Signal_1: 02-MIC (C33.2 D1.2 R19.2 TP1.1), 03-MCU (U9.13)
Signal_2: 02-MIC (C34.2 D2.2 R20.2 TP2.1), 03-MCU (U9.14)
Signal_3: 02-MIC (C48.2 D4.2 R39.2 TP4.1), 03-MCU (U9.15)
Signal_4: 02-MIC (C47.2 D3.2 R38.2 TP3.1), 03-MCU (U9.12)